# EAGLE design E3-Thermal-Sensor_v1 (EAGLE 6.5.0)
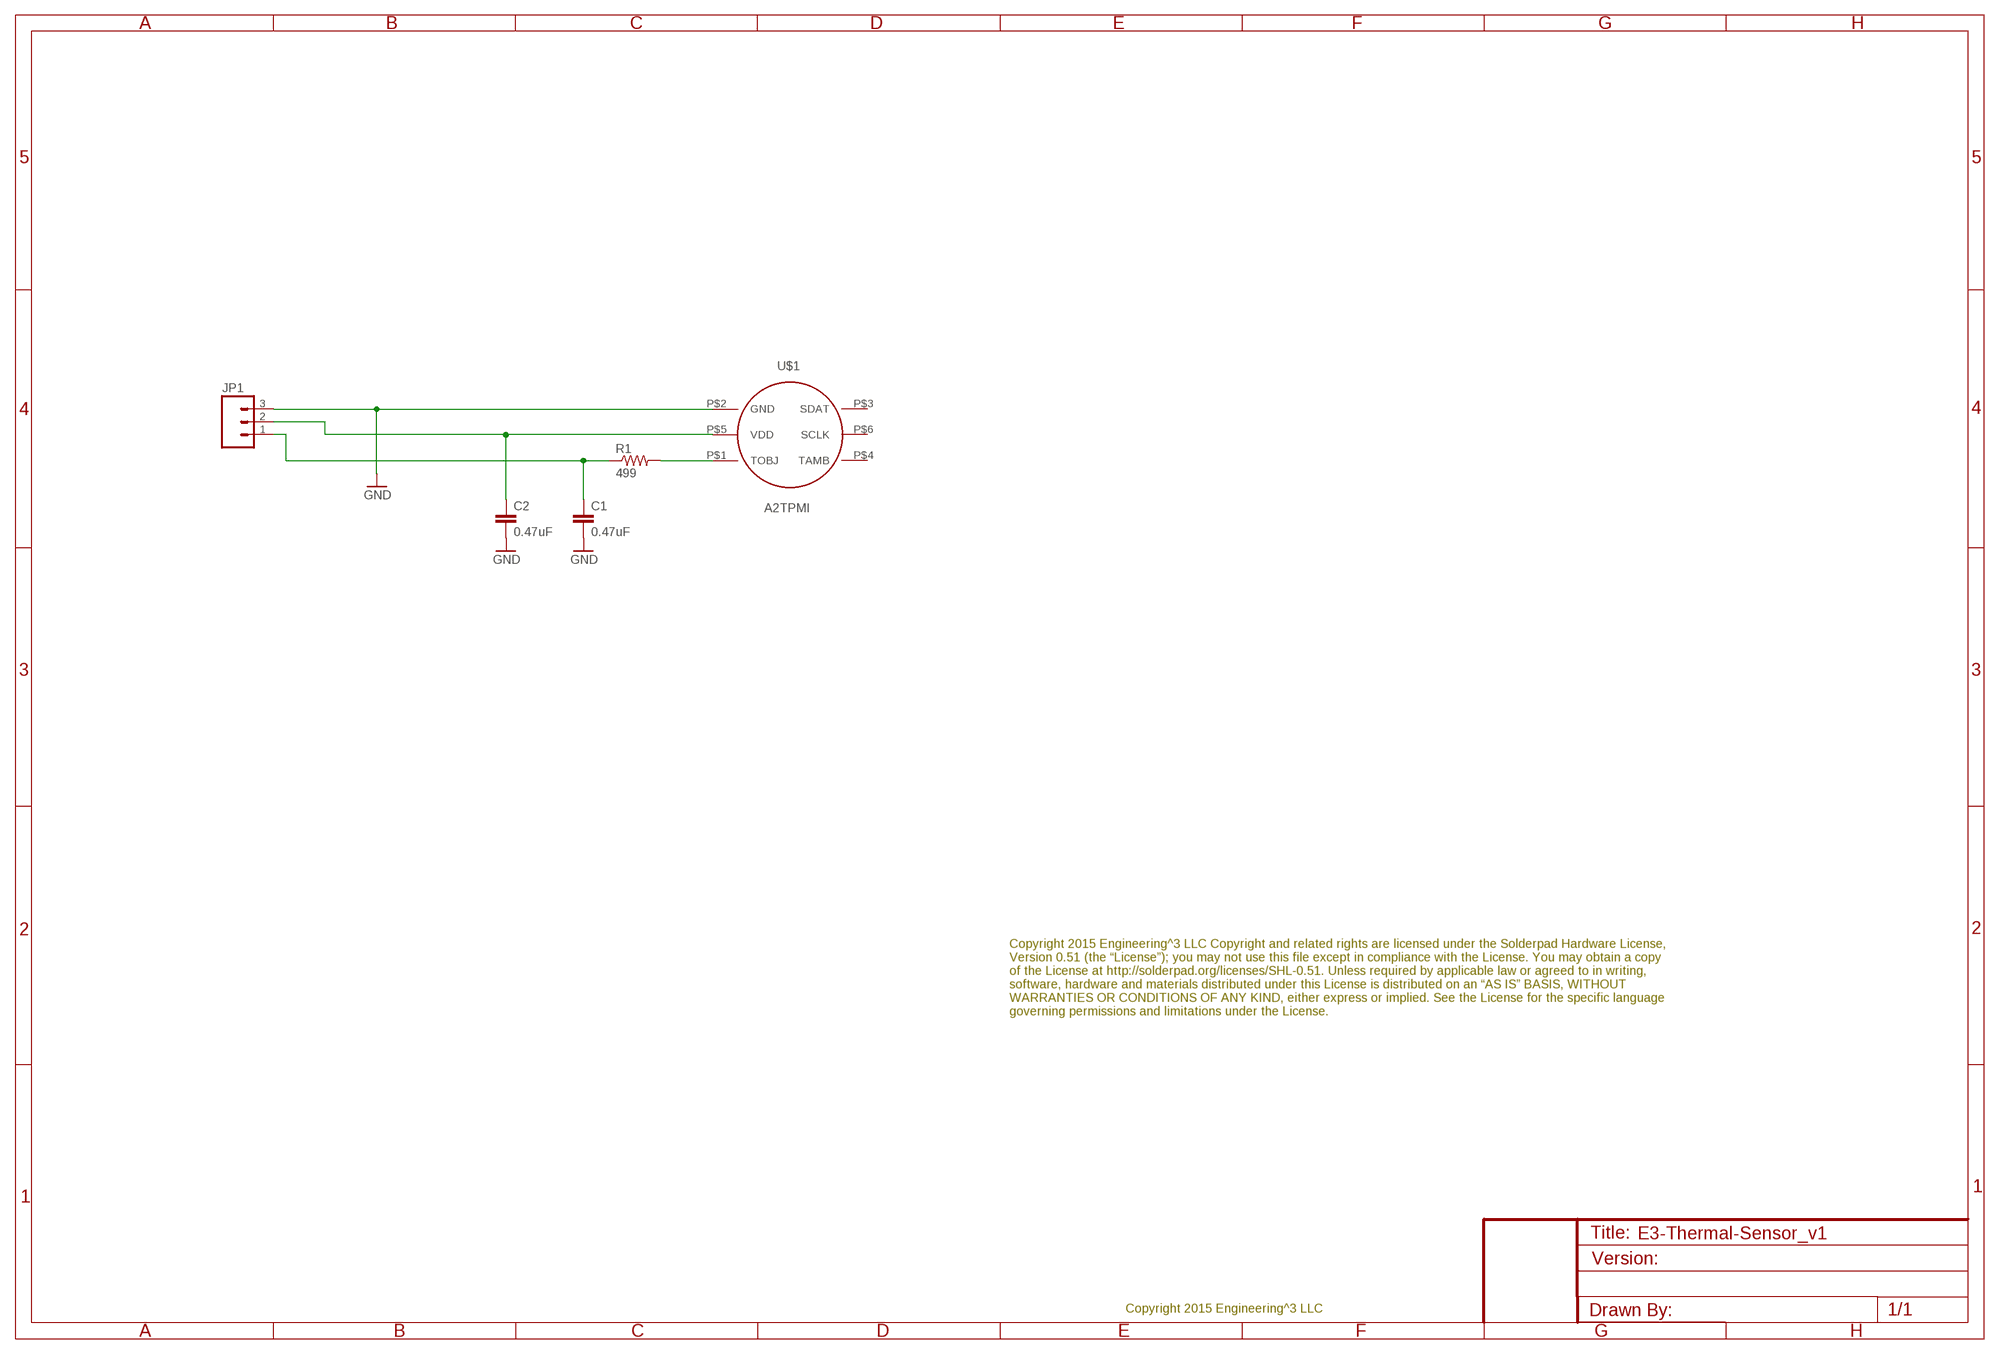
[diagram p0: schematic, sheet 1]

## Parts
C1  0.47uF  CAP0402  [C0402]
C2  0.47uF  CAP0402  [C0402]
JP1  M03PTH  [1X03]
R1  499  RESISTOR0402  [C0402]
U$1  A2TPMI  [A2TPMI]

## Nets
GND: C1.2 C2.2 JP1.3 U$1.P$2(GND)
N$1: C1.1 JP1.1 R1.1
N$2: R1.2 U$1.P$1(TOBJ)
N$4: C2.1 JP1.2 U$1.P$5(VDD)
Unconnected: U$1.P$3(SDAT) U$1.P$4(TAMB) U$1.P$6(SCLK)

## Notes on the sheet
- Copyright 2015 Engineering^3 LLC Copyright and related rights are licensed under the Solderpad Hardware License, 
  Version 0.51 (the “License”); you may not use this file except in compliance with the License. You may obtain a copy 
  of the License at http://solderpad.org/licenses/SHL-0.51. Unless required by applicable law or agreed to in writing, 
  software, hardware and materials distributed under this License is distributed on an “AS IS” BASIS, WITHOUT 
  WARRANTIES OR CONDITIONS OF ANY KIND, either express or implied. See the License for the specific language 
  governing permissions and limitations under the License.
- Copyright 2015 Engineering^3 LLC

## Library data of the parts
C1 C2 = SparkFun:CAP: Capacitor Standard 0603 ceramic capacitor, and 0.1" leaded capacitor.
JP1 = SparkFun:M03: Header 3 Standard 3-pin 0.1" header. Use with straight break away headers (SKU : PRT-00116), right angle break away headers (PRT-00553), swiss pins (PRT-00743), machine pins (PRT-00117), and female headers (PRT-00115). Molex polarized connector foot print use with SKU : PRT-08232 with associated crimp pins and housings.
R1 = SparkFun:RESISTOR: Resistor Basic schematic elements and footprints for 0603, 1206, and PTH 1/10th watt (small) resistors.
U$1 = JLY Parts:A2TPMI

## Board
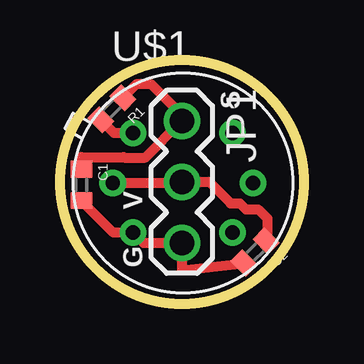
[diagram p1: board, top side]

Size 10.16 x 10.16 mm. Coordinates in mm from the lower left corner, seen from the top.
Outline: circle at 5.08,5.08 radius 5.08
Copper layers (1*16): Top 0.035mm / dielectric 1.5mm / Bottom 0.035mm
Design rules "default": minimum track width 10mil, minimum drill 24mil, track to track 8mil, track to pad 8mil, pad to pad 8mil, via to via 8mil, smd to smd 8mil, copper to edge 40mil, drill to drill 8mil, minimum pad ring 10mil, minimum via ring 8mil, stop-mask expansion 4mil, vias tented up to drill 0mil, thermal gap 10mil

### Footprints (pad centres in the part's own frame; a part is rotated, then mirrored left to right if it is on the bottom)
C0402 = smd 0.7 x 0.9: 1 -0.65,0; 2 0.65,0
1X03 = drill 1.016: 1 0,0; 2 2.54,0; 3 5.08,0
A2TPMI = drill 0.6: P$1 0,0; P$2 0,-4.14; P$3 4.14,-4.14; P$4 4.14,0; P$5 -0.851,-2.07; P$6 4.991,-2.07

### Placement (x,y rotation side)
C1  0.89,4.95 270 top
C2  8.13,2.16 225 top
JP1  5.08,7.62 270 top
R1  2.16,8.13 225 top
U$1  3.05,7.11 0 top

### Tracks (layer width: path | path; a pad name or v marks a point on that pad's centre or on a via)
GND
  Top 0.406: C2.2 5.08,1.4 JP1.3 3.48,2.54 U$1.P$2 2.22,2.97 C1.2
N$1
  Top 0.406: C1.1 0.89,6.11 2.65,6.11 2.67,6.1 3.56,6.1 JP1.1 5.08,7.87 3.81,9.14 3.17,9.14 R1.1
N$2
  Top 0.406: U$1.P$1 2.26,7.11 R1.2
N$4
  Top 0.406: U$1.P$5 5.04,5.04 JP1.2 6.22,5.08 7.11,4.19 7.49,4.19 7.75,3.94 8.25,3.94 8.64,3.56 8.64,2.67 C2.1

### Text on the board
tPlace: S | V | G